# Altium project proj_LAB_main.PrjPcb
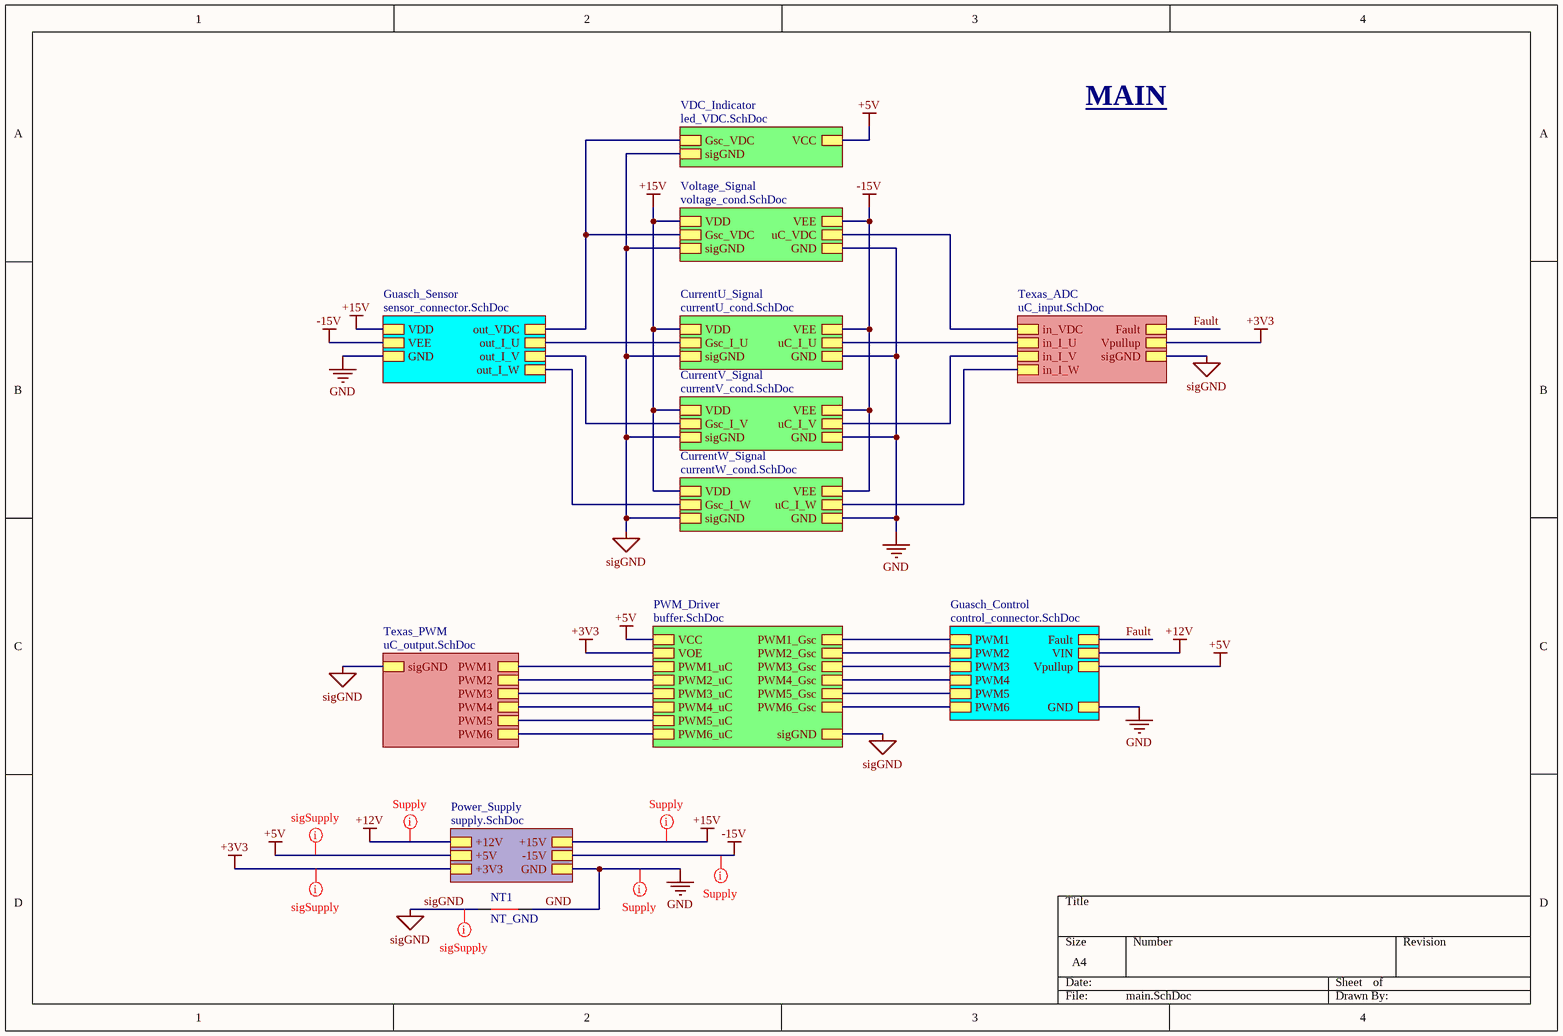
[diagram p0: main.SchDoc]
12 sheets, 127 parts. Net scope: hierarchical (ports join the sheet entries above them; power ports are global).
Board files: pcb_LAB_rev0.PcbDoc, pcb_LAB_rev1.PcbDoc
Sheets:
  main.SchDoc
    PWM_Driver = buffer.SchDoc
    Guasch_Control = control_connector.SchDoc
    Guasch_Sensor = sensor_connector.SchDoc
    CurrentU_Signal = currentU_cond.SchDoc
    Voltage_Signal = voltage_cond.SchDoc
    Texas_ADC = uC_input.SchDoc
    Texas_PWM = uC_output.SchDoc
    CurrentV_Signal = currentV_cond.SchDoc
    CurrentW_Signal = currentW_cond.SchDoc
    Power_Supply = supply.SchDoc
    VDC_Indicator = led_VDC.SchDoc

## Sheet main.SchDoc
size A4; SheetNumber: 1; SheetTotal: 12

### Parts
NT1  NT_GND  [NetTie_GND]  (net tie, no BOM)

### Sub-sheets
CurrentU_Signal = currentU_cond.SchDoc: Gsc_I_U, uC_I_U, VDD, VEE, GND, sigGND
CurrentV_Signal = currentV_cond.SchDoc: Gsc_I_V, uC_I_V, VDD, VEE, GND, sigGND
CurrentW_Signal = currentW_cond.SchDoc: Gsc_I_W, uC_I_W, VDD, VEE, GND, sigGND
Guasch_Control = control_connector.SchDoc: PWM1, PWM2, PWM3, Fault, PWM4, PWM5, PWM6, VIN, Vpullup, GND
Guasch_Sensor = sensor_connector.SchDoc: out_I_U, out_I_V, out_I_W, VDD, VEE, GND, out_VDC
Power_Supply = supply.SchDoc: +15V, -15V, +12V, +5V, +3V3, GND
PWM_Driver = buffer.SchDoc: PWM1_uC, PWM2_uC, PWM3_uC, PWM4_uC, PWM5_uC, PWM6_uC, PWM1_Gsc, PWM2_Gsc, PWM3_Gsc, PWM4_Gsc, PWM5_Gsc, PWM6_Gsc, VCC, VOE, sigGND
Texas_ADC = uC_input.SchDoc: in_VDC, in_I_U, in_I_V, in_I_W, Fault, Vpullup, sigGND
Texas_PWM = uC_output.SchDoc: PWM1, PWM2, PWM3, PWM4, PWM5, PWM6, sigGND
VDC_Indicator = led_VDC.SchDoc: VCC, Gsc_VDC, sigGND
Voltage_Signal = voltage_cond.SchDoc: Gsc_VDC, uC_VDC, VDD, VEE, GND, sigGND

### Nets
+3V3: sheet PWM_Driver/VOE, sheet Texas_ADC/Vpullup, sheet Power_Supply/+3V3
+5V: sheet PWM_Driver/VCC, sheet Guasch_Control/Vpullup, sheet Power_Supply/+5V, sheet VDC_Indicator/VCC
+12V: sheet Guasch_Control/VIN, sheet Power_Supply/+12V
+15V: sheet Guasch_Sensor/VDD, sheet CurrentU_Signal/VDD, sheet Voltage_Signal/VDD, sheet CurrentV_Signal/VDD, sheet CurrentW_Signal/VDD, sheet Power_Supply/+15V
-15V: sheet Guasch_Sensor/VEE, sheet CurrentU_Signal/VEE, sheet Voltage_Signal/VEE, sheet CurrentV_Signal/VEE, sheet CurrentW_Signal/VEE, sheet Power_Supply/-15V
GND: NT1.1 ; sheet Guasch_Control/GND, sheet Guasch_Sensor/GND, sheet CurrentU_Signal/GND, sheet Voltage_Signal/GND, sheet CurrentV_Signal/GND, sheet CurrentW_Signal/GND, sheet Power_Supply/GND
sigGND: NT1.0 ; sheet PWM_Driver/sigGND, sheet CurrentU_Signal/sigGND, sheet Voltage_Signal/sigGND, sheet Texas_ADC/sigGND, sheet Texas_PWM/sigGND, sheet CurrentV_Signal/sigGND, sheet CurrentW_Signal/sigGND, sheet VDC_Indicator/sigGND
A/D A2: sheet CurrentU_Signal/uC_I_U, sheet Texas_ADC/in_I_U
A/D A3: sheet Voltage_Signal/uC_VDC, sheet Texas_ADC/in_VDC
A/D A4: sheet Texas_ADC/in_I_V, sheet CurrentV_Signal/uC_I_V
A/D A5: sheet Texas_ADC/in_I_W, sheet CurrentW_Signal/uC_I_W
Fault: sheet Guasch_Control/Fault, sheet Texas_ADC/Fault
Gsc_VDC: sheet Guasch_Sensor/out_VDC, sheet Voltage_Signal/Gsc_VDC, sheet VDC_Indicator/Gsc_VDC
PWM1_Gsc: sheet PWM_Driver/PWM1_Gsc, sheet Guasch_Control/PWM1
PWM2_Gsc: sheet PWM_Driver/PWM2_Gsc, sheet Guasch_Control/PWM2
PWM2A: sheet PWM_Driver/PWM3_uC, sheet Texas_PWM/PWM3
PWM2B: sheet PWM_Driver/PWM4_uC, sheet Texas_PWM/PWM4
PWM3_Gsc: sheet PWM_Driver/PWM3_Gsc, sheet Guasch_Control/PWM3
PWM3A: sheet PWM_Driver/PWM1_uC, sheet Texas_PWM/PWM1
PWM3B: sheet PWM_Driver/PWM2_uC, sheet Texas_PWM/PWM2
PWM4_Gsc: sheet PWM_Driver/PWM4_Gsc, sheet Guasch_Control/PWM4
PWM5_Gsc: sheet PWM_Driver/PWM5_Gsc, sheet Guasch_Control/PWM5
PWM6_Gsc: sheet PWM_Driver/PWM6_Gsc, sheet Guasch_Control/PWM6
PWM6A: sheet PWM_Driver/PWM5_uC, sheet Texas_PWM/PWM5
PWM6B: sheet PWM_Driver/PWM6_uC, sheet Texas_PWM/PWM6
NetJ1_3: sheet Guasch_Sensor/out_I_U, sheet CurrentU_Signal/Gsc_I_U
NetJ1_4: sheet Guasch_Sensor/out_I_V, sheet CurrentV_Signal/Gsc_I_V
NetJ1_5: sheet Guasch_Sensor/out_I_W, sheet CurrentW_Signal/Gsc_I_W

### Layout directives
net class Supply: +12V, +15V, -15V, GND
net class sigSupply: +3V3, +5V, sigGND

### Notes on the sheet
- MAIN

### Library data of the parts
NT1 = NetTIe_GND: Net Tie for GND, at bottom layer

## Sheet buffer.SchDoc
size A4; SheetNumber: 8; SheetTotal: 12
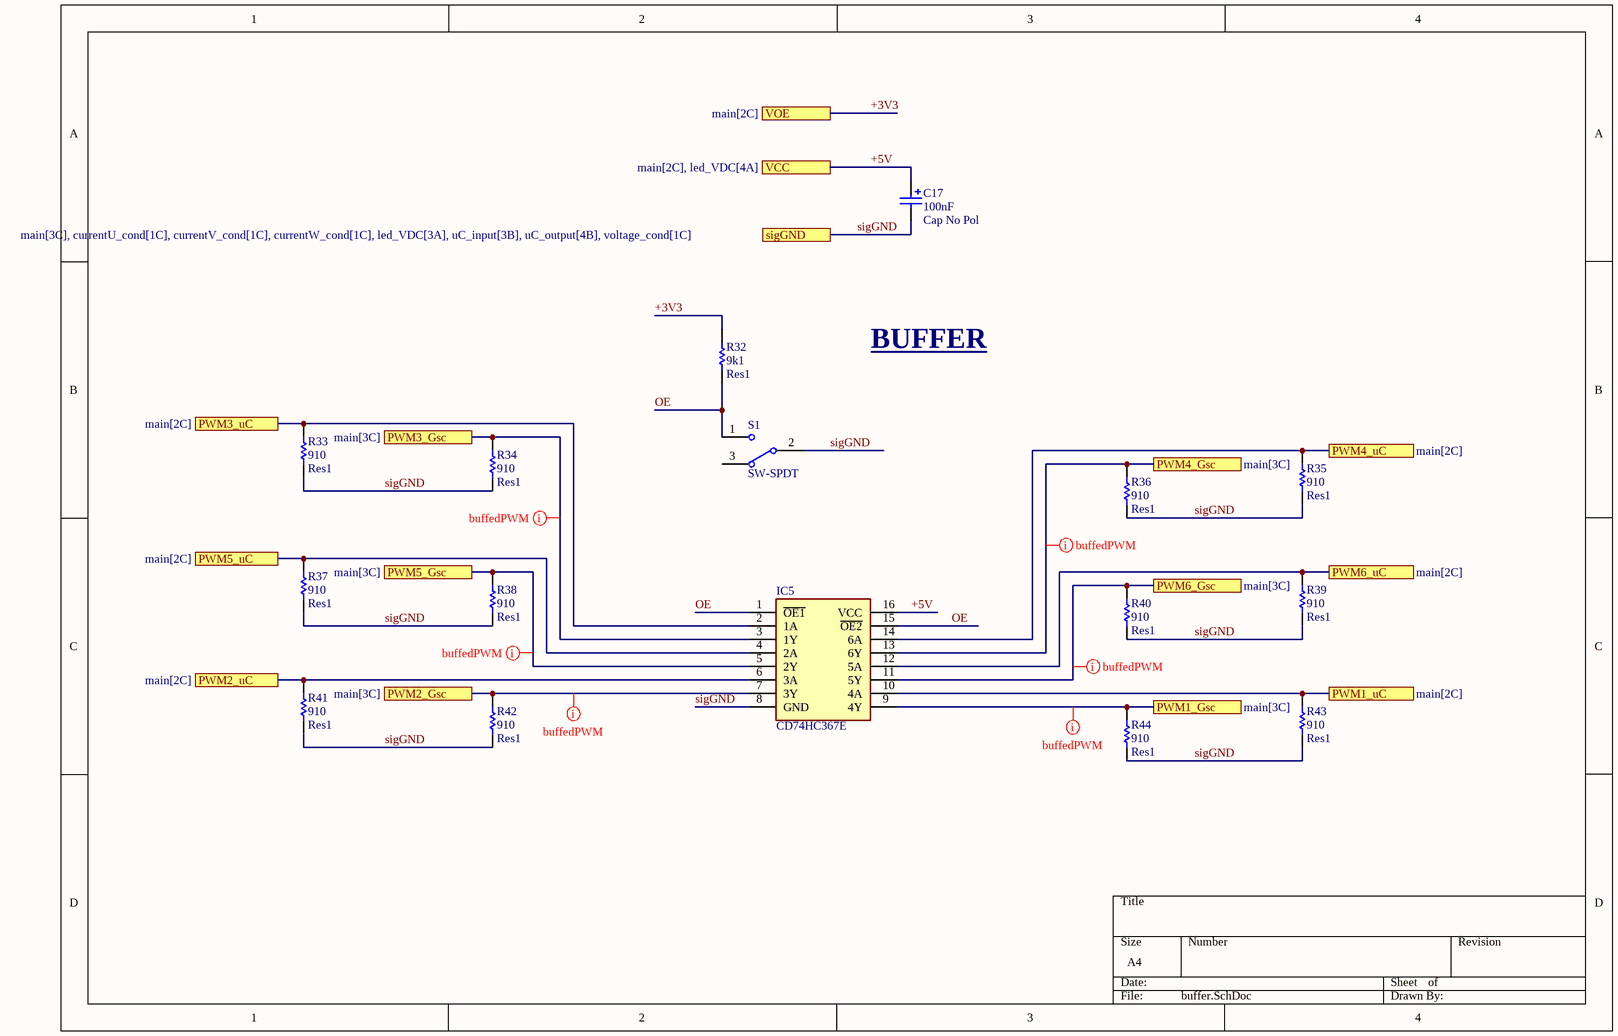
[diagram p1: buffer.SchDoc]

### Parts
C17  Cap No Pol  value 100nF  [RAD-0.1_mod]
IC5  CD74HC367E  [DIP-16_mod]
R32  Res1  value 9k1  [AXIAL-0.3_mod]
R33  Res1  value 910  [AXIAL-0.3_mod]
R34  Res1  value 910  [AXIAL-0.3_mod]
R35  Res1  value 910  [AXIAL-0.3_mod]
R36  Res1  value 910  [AXIAL-0.3_mod]
R37  Res1  value 910  [AXIAL-0.3_mod]
R38  Res1  value 910  [AXIAL-0.3_mod]
R39  Res1  value 910  [AXIAL-0.3_mod]
R40  Res1  value 910  [AXIAL-0.3_mod]
R41  Res1  value 910  [AXIAL-0.3_mod]
R42  Res1  value 910  [AXIAL-0.3_mod]
R43  Res1  value 910  [AXIAL-0.3_mod]
R44  Res1  value 910  [AXIAL-0.3_mod]
S1  SW-SPDT  [MHDR1X3_mod]

### Ports
PWM1_Gsc (see main[3C]), PWM1_uC (see main[2C]), PWM2_Gsc (see main[3C]), PWM2_uC (see main[2C]), PWM3_Gsc (see main[3C]), PWM3_uC (see main[2C]), PWM4_Gsc (see main[3C]), PWM4_uC (see main[2C]), PWM5_Gsc (see main[3C]), PWM5_uC (see main[2C]), PWM6_Gsc (see main[3C]), PWM6_uC (see main[2C]), sigGND (see main[3C], currentU_cond[1C], currentV_cond[1C], currentW_cond[1C], led_VDC[3A], uC_input[3B], uC_output[4B], voltage_cond[1C]), VCC (see main[2C], led_VDC[4A]), VOE (see main[2C])

### Nets
+3V3: R32.2 ; port VOE
+5V: C17.1 IC5.16(VCC) ; port VCC
sigGND: C17.2 IC5.8(GND) R33.1 R34.1 R35.1 R36.1 R37.1 R38.1 R39.1 R40.1 R41.1 R42.1 R43.1 R44.1 S1.2 ; port sigGND
OE: IC5.1(~{OE1}) IC5.15(~{OE2}) R32.1 S1.1
PWM1_Gsc: IC5.9(4Y) R44.2 ; port PWM1_Gsc
PWM2_Gsc: IC5.7(3Y) R42.2 ; port PWM2_Gsc
PWM2A: IC5.2(1A) R33.2 ; port PWM3_uC
PWM2B: IC5.14(6A) R35.2 ; port PWM4_uC
PWM3_Gsc: IC5.3(1Y) R34.2 ; port PWM3_Gsc
PWM3A: IC5.10(4A) R43.2 ; port PWM1_uC
PWM3B: IC5.6(3A) R41.2 ; port PWM2_uC
PWM4_Gsc: IC5.13(6Y) R36.2 ; port PWM4_Gsc
PWM5_Gsc: IC5.5(2Y) R38.2 ; port PWM5_Gsc
PWM6_Gsc: IC5.11(5Y) R40.2 ; port PWM6_Gsc
PWM6A: IC5.4(2A) R37.2 ; port PWM5_uC
PWM6B: IC5.12(5A) R39.2 ; port PWM6_uC

Not connected (* = marked no-connect by the designer): S1 3

### Layout directives
net class buffedPWM: PWM1_Gsc, PWM2_Gsc, PWM3_Gsc, PWM4_Gsc, PWM5_Gsc, PWM6_Gsc

### Notes on the sheet
- BUFFER

### Library data of the parts
C17 = Cap No Pol: Polarized Capacitor (Radial); Published: 8-Jun-2000; LatestRevisionDate: 17-Jul-2002; LatestRevisionNote: Re-released for DXP Platform.; PackageReference: RB7.6-15; Publisher: Altium Limited; PackageDescription: Polarized Capacitor (Radial); 2 Leads
IC5 = CD74HC367E: Integrated Circuit; Manufacturer_Name: Texas Instruments; Datasheet Link: https://www.ti.com/lit/ds/symlink/cd74hc367.pdf?ts=1619589374451&ref_url=https%253A%252F%252Fwww.ti.com%252Fstore%252Fti%252Fen%252Fp%252Fproduct%252F%253Fp%253DCD74HC367E; Height: 5.08mm; Manufacturer_Part_Number: CD74HC367E; Mouser Part Number: 595-CD74HC367E; Mouser Price/Stock: https://www.mouser.co.uk/ProductDetail/Texas-Instruments/CD74HC367E?qs=xFfolx0DHx1dmtXXzN7naA%3D%3D
R32-R44 = Res1: Resistor; Published: 8-Jun-2000; LatestRevisionDate: 17-Jul-2002; LatestRevisionNote: Re-released for DXP Platform.; PackageReference: AXIAL-0.3; Publisher: Altium Limited; PackageDescription: Axial Device, Thru-Hole; 2 Leads; 0.3 in Pin Spacing
S1 = SW-SPDT: SPDT Subminiature Toggle Switch, Right Angle Mounting, Vertical Actuation; Published: 24-Mar-1999; LatestRevisionDate: 17-Dec-2003; LatestRevisionNote: Schematic revised, PCB Footprint replaced.; DatasheetVersion: 05-Dec-2000; PackageReference: TL36WW15050; Publisher: Altium Limited; PackageDescription: Switch; 4 Leads; ComponentLink1Description: Manufacturer Link; ComponentLink1URL: http://www.apem.com

## Sheet control_connector.SchDoc
size A4; SheetNumber: 7; SheetTotal: 12; SPICEModelCacheRONAVTZR: <root> / <DocumentId>RONAVTZR</DocumentId> / </root>
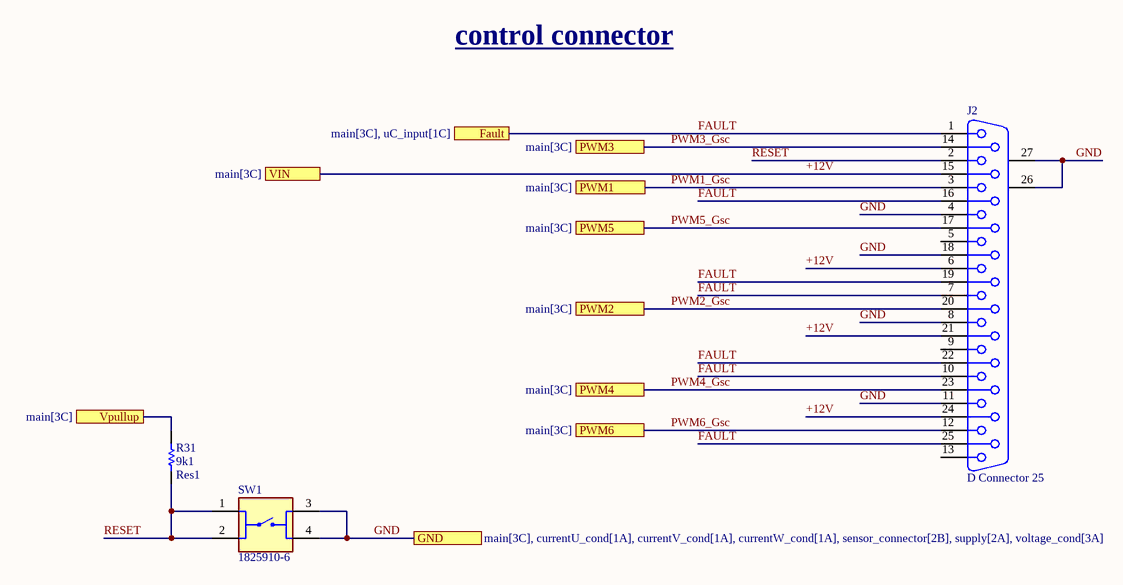
[diagram p2: control_connector.SchDoc]

### Parts
J2  D Connector 25  [DSUB1.385-2H25A_mod]
R31  Res1  value 9k1  [AXIAL-0.3_mod]
SW1  1825910-6  [SW_1825910-6-4_mod]

### Ports
Fault (see main[3C], uC_input[1C]), GND (see main[3C], currentU_cond[1A], currentV_cond[1A], currentW_cond[1A], sensor_connector[2B], supply[2A], voltage_cond[3A]), PWM1 (see main[3C]), PWM2 (see main[3C]), PWM3 (see main[3C]), PWM4 (see main[3C]), PWM5 (see main[3C]), PWM6 (see main[3C]), VIN (see main[3C]), Vpullup (see main[3C])

### Nets
+5V: R31.2 ; port Vpullup
+12V: J2.6 J2.15 J2.21 J2.24 ; port VIN
GND: J2.4 J2.8 J2.11 J2.18 J2.26(MH1) J2.27(MH2) SW1.3 SW1.4 ; port GND
Fault: J2.1 J2.7 J2.10 J2.16 J2.19 J2.22 J2.25 ; port Fault
PWM1_Gsc: J2.3 ; port PWM1
PWM2_Gsc: J2.20 ; port PWM2
PWM3_Gsc: J2.14 ; port PWM3
PWM4_Gsc: J2.23 ; port PWM4
PWM5_Gsc: J2.17 ; port PWM5
PWM6_Gsc: J2.12 ; port PWM6
RESET: J2.2 R31.1 SW1.1 SW1.2

Not connected (* = marked no-connect by the designer): J2 5 9 13

### Notes on the sheet
- control connector

### Library data of the parts
J2 = D Connector 25: Receptacle Assembly, 25 Position, Right Angle; PackageDocument: U; Positions: 25; Published: 15-Jun-2001; LatestRevisionDate: 17-Jul-2002; LatestRevisionNote: Re-released for DXP Platform.; DatasheetDocument: 19-Mar-1999; PackageReference: 787202; Publisher: Altium Limited; Orientation: Right Angle; Gender: Receptacle
R31 = Res1: Resistor; Published: 8-Jun-2000; LatestRevisionDate: 17-Jul-2002; LatestRevisionNote: Re-released for DXP Platform.; PackageReference: AXIAL-0.3; Publisher: Altium Limited; PackageDescription: Axial Device, Thru-Hole; 2 Leads; 0.3 in Pin Spacing
SW1 = 1825910-6: Switch Push Button OFF (ON) SPST Round Button 0.05A 24VDC Momentary Contact PC Pins Thru-Hole; MF: TE Connectivity; Value: *; MP: 1825910-6; Package: None; Check_prices: https://www.snapeda.com/parts/1825910-6/TE+Connectivity+ALCOSWITCH+Switches/view-part/?ref=eda; SnapEDA_Link: https://www.snapeda.com/parts/1825910-6/TE+Connectivity+ALCOSWITCH+Switches/view-part/?ref=snap; Digi-Key_Part_Number: 450-1650-ND; Purchase-URL: https://pricing.snapeda.com/search/part/1825910-6/?ref=eda

## Sheet sensor_connector.SchDoc
size A4; SheetNumber: 6; SheetTotal: 12
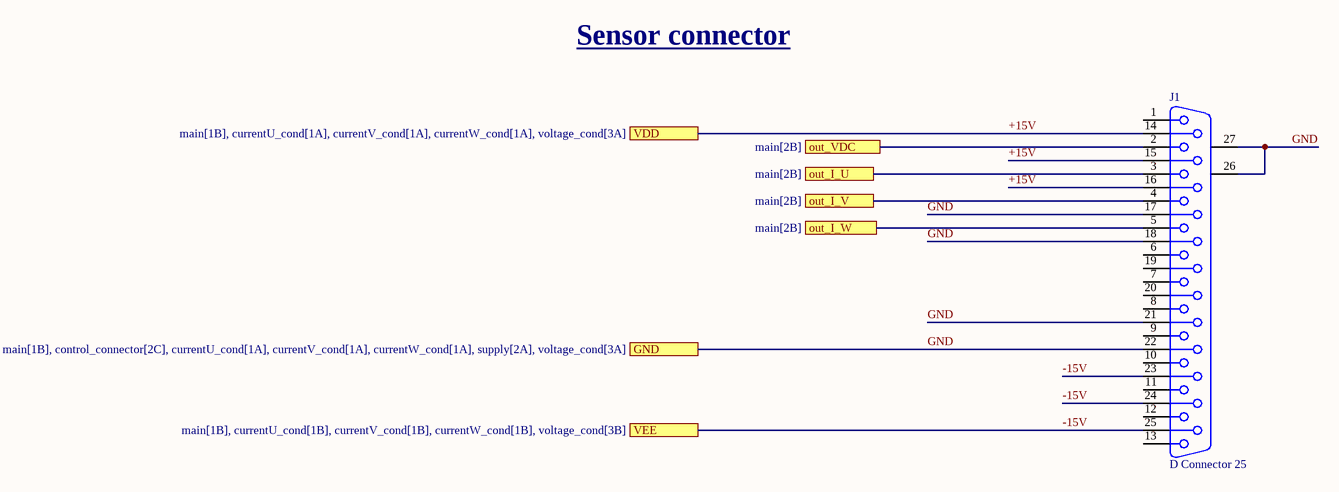
[diagram p3: sensor_connector.SchDoc]

### Parts
J1  D Connector 25  [DSUB1.385-2H25A_mod]

### Ports
GND (see main[1B], control_connector[2C], currentU_cond[1A], currentV_cond[1A], currentW_cond[1A], supply[2A], voltage_cond[3A]), out_I_U (see main[2B]), out_I_V (see main[2B]), out_I_W (see main[2B]), out_VDC (see main[2B]), VDD (see main[1B], currentU_cond[1A], currentV_cond[1A], currentW_cond[1A], voltage_cond[3A]), VEE (see main[1B], currentU_cond[1B], currentV_cond[1B], currentW_cond[1B], voltage_cond[3B])

### Nets
+15V: J1.14 J1.15 J1.16 ; port VDD
-15V: J1.23 J1.24 J1.25 ; port VEE
GND: J1.17 J1.18 J1.21 J1.22 J1.26(MH1) J1.27(MH2) ; port GND
Gsc_VDC: J1.2 ; port out_VDC
NetJ1_3: J1.3 ; port out_I_U
NetJ1_4: J1.4 ; port out_I_V
NetJ1_5: J1.5 ; port out_I_W

Not connected (* = marked no-connect by the designer): J1 1 6 7 8 9 10 11 12 13 19 20

### Notes on the sheet
- Sensor connector

### Library data of the parts
J1 = D Connector 25: as J2 on sheet control_connector; Published: 15-Jun-2001; LatestRevisionDate: 17-Jul-2002; LatestRevisionNote: Re-released for DXP Platform.; DatasheetDocument: 19-Mar-1999; PackageReference: 787202; Publisher: Altium Limited; Orientation: Right Angle; Gender: Receptacle

## Sheet currentU_cond.SchDoc
size A4; SheetNumber: 2; SheetTotal: 12; SPICEModelCacheJNOYGZHY: <root> / <DocumentId>JNOYGZHY</DocumentId> / </root>
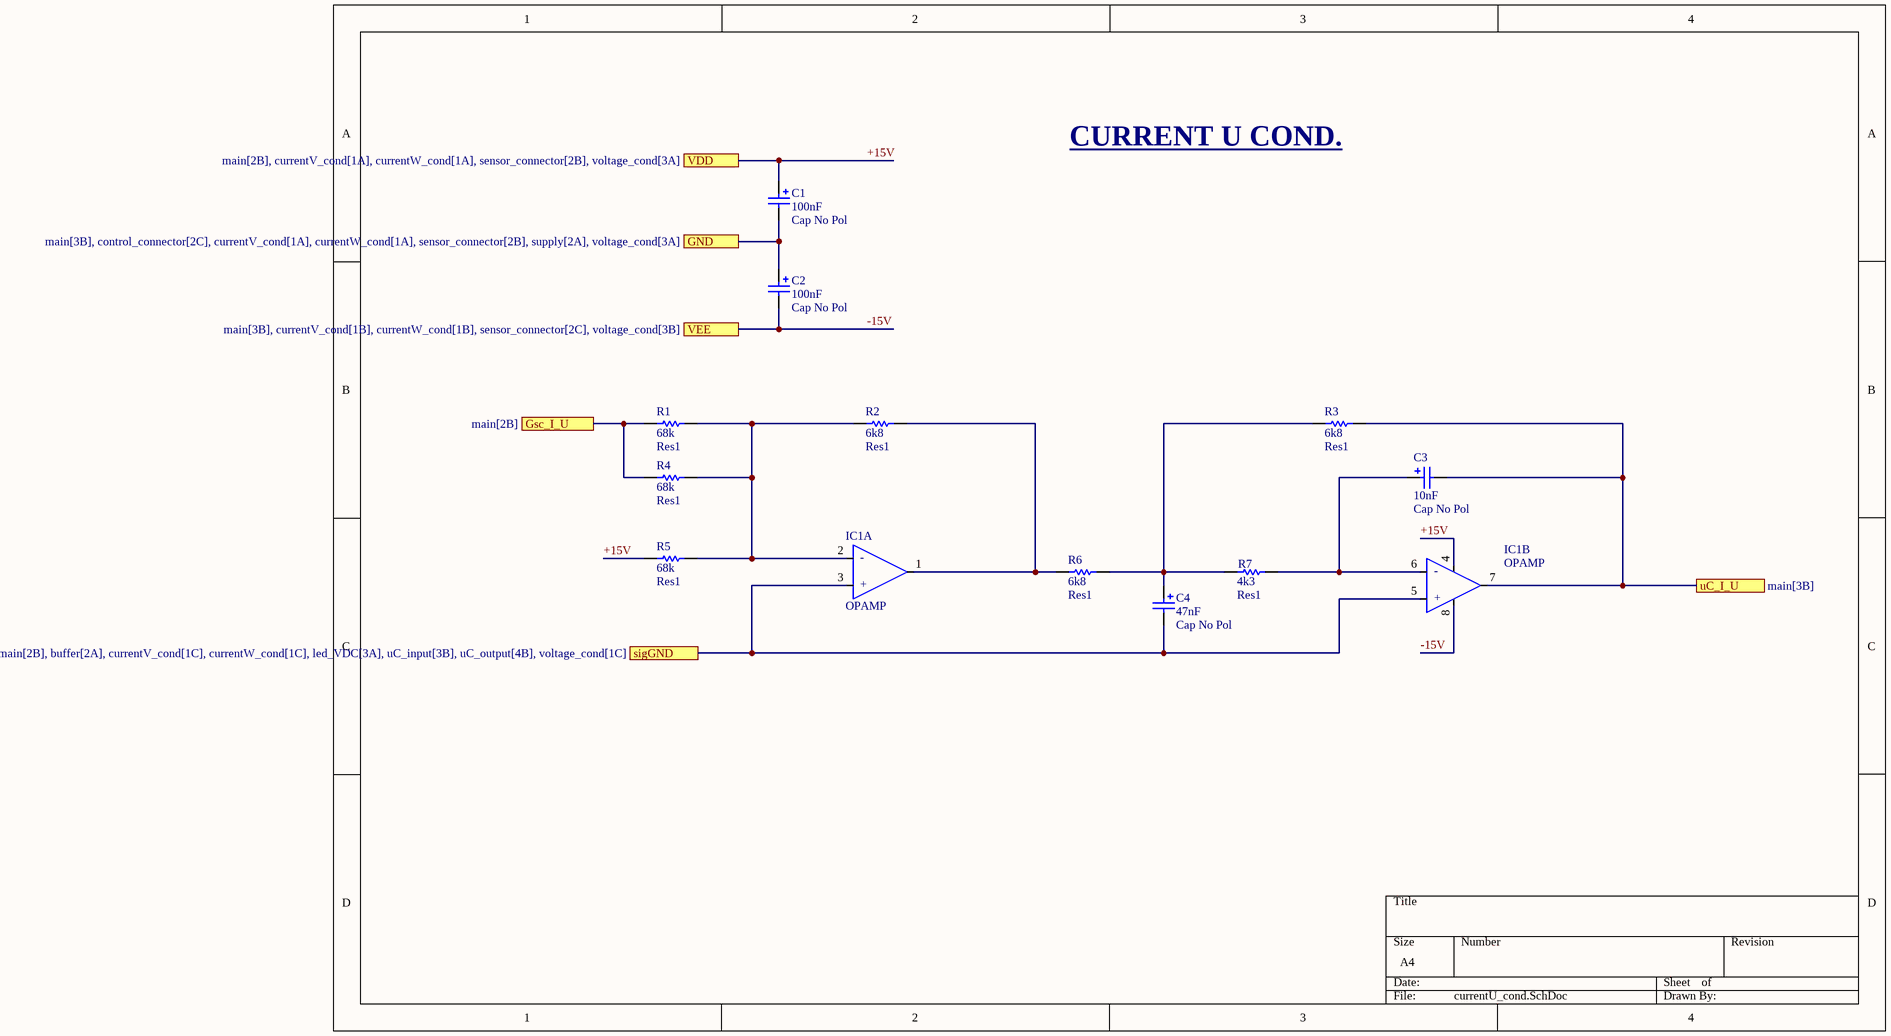
[diagram p4: currentU_cond.SchDoc]

### Parts
C1  Cap No Pol  value 100nF  [RAD-0.1_mod]
C2  Cap No Pol  value 100nF  [RAD-0.1_mod]
C3  Cap No Pol  value 10nF  [RAD-0.1_mod]
C4  Cap No Pol  value 47nF  [RAD-0.1_mod]
IC1  OPAMP  [DIP-8_mod]  (parts A,B of 2)
R1  Res1  value 68k  [AXIAL-0.3_mod]
R2  Res1  value 6k8  [AXIAL-0.3_mod]
R3  Res1  value 6k8  [AXIAL-0.3_mod]
R4  Res1  value 68k  [AXIAL-0.3_mod]
R5  Res1  value 68k  [AXIAL-0.3_mod]
R6  Res1  value 6k8  [AXIAL-0.3_mod]
R7  Res1  value 4k3  [AXIAL-0.3_mod]

### Ports
GND (see main[3B], control_connector[2C], currentV_cond[1A], currentW_cond[1A], sensor_connector[2B], supply[2A], voltage_cond[3A]), Gsc_I_U (see main[2B]), sigGND (see main[2B], buffer[2A], currentV_cond[1C], currentW_cond[1C], led_VDC[3A], uC_input[3B], uC_output[4B], voltage_cond[1C]), uC_I_U (see main[3B]), VDD (see main[2B], currentV_cond[1A], currentW_cond[1A], sensor_connector[2B], voltage_cond[3A]), VEE (see main[3B], currentV_cond[1B], currentW_cond[1B], sensor_connector[2C], voltage_cond[3B])

### Nets
+15V: C1.1 IC1.4(-V) R5.1 ; port VDD
-15V: C2.2 IC1.8(V+) ; port VEE
GND: C1.2 C2.1 ; port GND
sigGND: C4.2 IC1.3(IN_A_+) IC1.5(IN_B_+) ; port sigGND
A/D A2: C3.2 IC1.7(OUT_B) R3.2 ; port uC_I_U
NetC3_1: C3.1 IC1.6(IN_B_-) R7.2
NetC4_1: C4.1 R3.1 R6.2 R7.1
NetIC1_1: IC1.1(OUT_A) R2.2 R6.1
NetIC1_2: IC1.2(IN_A_-) R1.2 R2.1 R4.2 R5.2
NetJ1_3: R1.1 R4.1 ; port Gsc_I_U

### Notes on the sheet
- CURRENT U COND.
- (in symbol ADTL082, part A) -; +
- (in symbol ADTL082, part B) -; +

### Library data of the parts
C1-C4 = Cap No Pol: Polarized Capacitor (Radial); Published: 8-Jun-2000; LatestRevisionDate: 17-Jul-2002; LatestRevisionNote: Re-released for DXP Platform.; PackageReference: RB7.6-15; Publisher: Altium Limited; PackageDescription: Polarized Capacitor (Radial); 2 Leads
IC1 = ADTL082
R1-R7 = Res1: Resistor; Published: 8-Jun-2000; LatestRevisionDate: 17-Jul-2002; LatestRevisionNote: Re-released for DXP Platform.; PackageReference: AXIAL-0.3; Publisher: Altium Limited; PackageDescription: Axial Device, Thru-Hole; 2 Leads; 0.3 in Pin Spacing

## Sheet voltage_cond.SchDoc
size A4; SheetNumber: 5; SheetTotal: 12
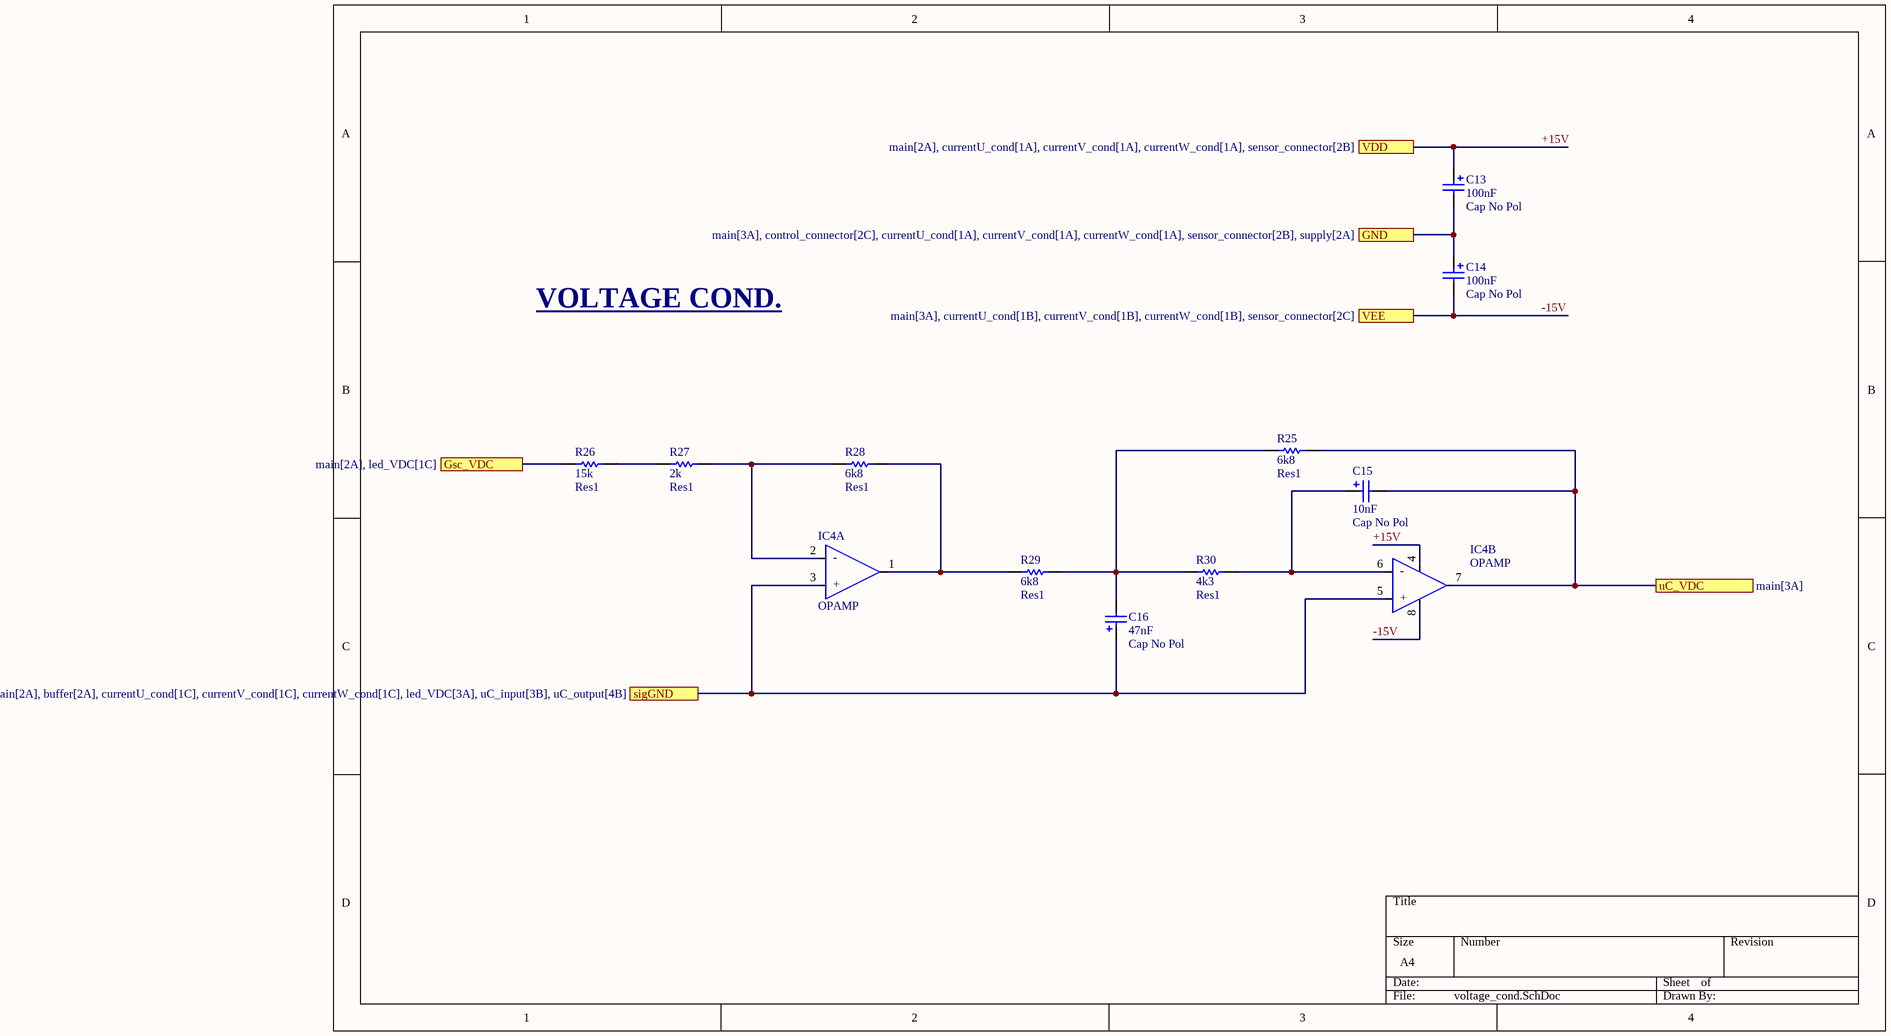
[diagram p5: voltage_cond.SchDoc]

### Parts
C13  Cap No Pol  value 100nF  [RAD-0.1_mod]
C14  Cap No Pol  value 100nF  [RAD-0.1_mod]
C15  Cap No Pol  value 10nF  [RAD-0.1_mod]
C16  Cap No Pol  value 47nF  [RAD-0.1_mod]
IC4  OPAMP  [DIP-8_mod]  (parts A,B of 2)
R25  Res1  value 6k8  [AXIAL-0.3_mod]
R26  Res1  value 15k  [AXIAL-0.3_mod]
R27  Res1  value 2k  [AXIAL-0.3_mod]
R28  Res1  value 6k8  [AXIAL-0.3_mod]
R29  Res1  value 6k8  [AXIAL-0.3_mod]
R30  Res1  value 4k3  [AXIAL-0.3_mod]

### Ports
GND (see main[3A], control_connector[2C], currentU_cond[1A], currentV_cond[1A], currentW_cond[1A], sensor_connector[2B], supply[2A]), Gsc_VDC (see main[2A], led_VDC[1C]), sigGND (see main[2A], buffer[2A], currentU_cond[1C], currentV_cond[1C], currentW_cond[1C], led_VDC[3A], uC_input[3B], uC_output[4B]), uC_VDC (see main[3A]), VDD (see main[2A], currentU_cond[1A], currentV_cond[1A], currentW_cond[1A], sensor_connector[2B]), VEE (see main[3A], currentU_cond[1B], currentV_cond[1B], currentW_cond[1B], sensor_connector[2C])

### Nets
+15V: C13.1 IC4.4(-V) ; port VDD
-15V: C14.2 IC4.8(V+) ; port VEE
GND: C13.2 C14.1 ; port GND
sigGND: C16.1 IC4.3(IN_A_+) IC4.5(IN_B_+) ; port sigGND
A/D A3: C15.2 IC4.7(OUT_B) R25.2 ; port uC_VDC
Gsc_VDC: R26.1 ; port Gsc_VDC
NetC15_1: C15.1 IC4.6(IN_B_-) R30.2
NetC16_2: C16.2 R25.1 R29.2 R30.1
NetIC4_1: IC4.1(OUT_A) R28.2 R29.1
NetIC4_2: IC4.2(IN_A_-) R27.2 R28.1
NetR26_2: R26.2 R27.1

### Notes on the sheet
- VOLTAGE COND.
- (in symbol ADTL082, part A) -; +
- (in symbol ADTL082, part B) -; +

### Library data of the parts
C13-C16 = Cap No Pol: Polarized Capacitor (Radial); Published: 8-Jun-2000; LatestRevisionDate: 17-Jul-2002; LatestRevisionNote: Re-released for DXP Platform.; PackageReference: RB7.6-15; Publisher: Altium Limited; PackageDescription: Polarized Capacitor (Radial); 2 Leads
IC4 = ADTL082
R25-R30 = Res1: Resistor; Published: 8-Jun-2000; LatestRevisionDate: 17-Jul-2002; LatestRevisionNote: Re-released for DXP Platform.; PackageReference: AXIAL-0.3; Publisher: Altium Limited; PackageDescription: Axial Device, Thru-Hole; 2 Leads; 0.3 in Pin Spacing

## Sheet uC_input.SchDoc
size A; SheetNumber: 10; SheetTotal: 12; SPICEModelCacheXWDQNBJN: <root> / <DocumentId>XWDQNBJN</DocumentId> / </root>
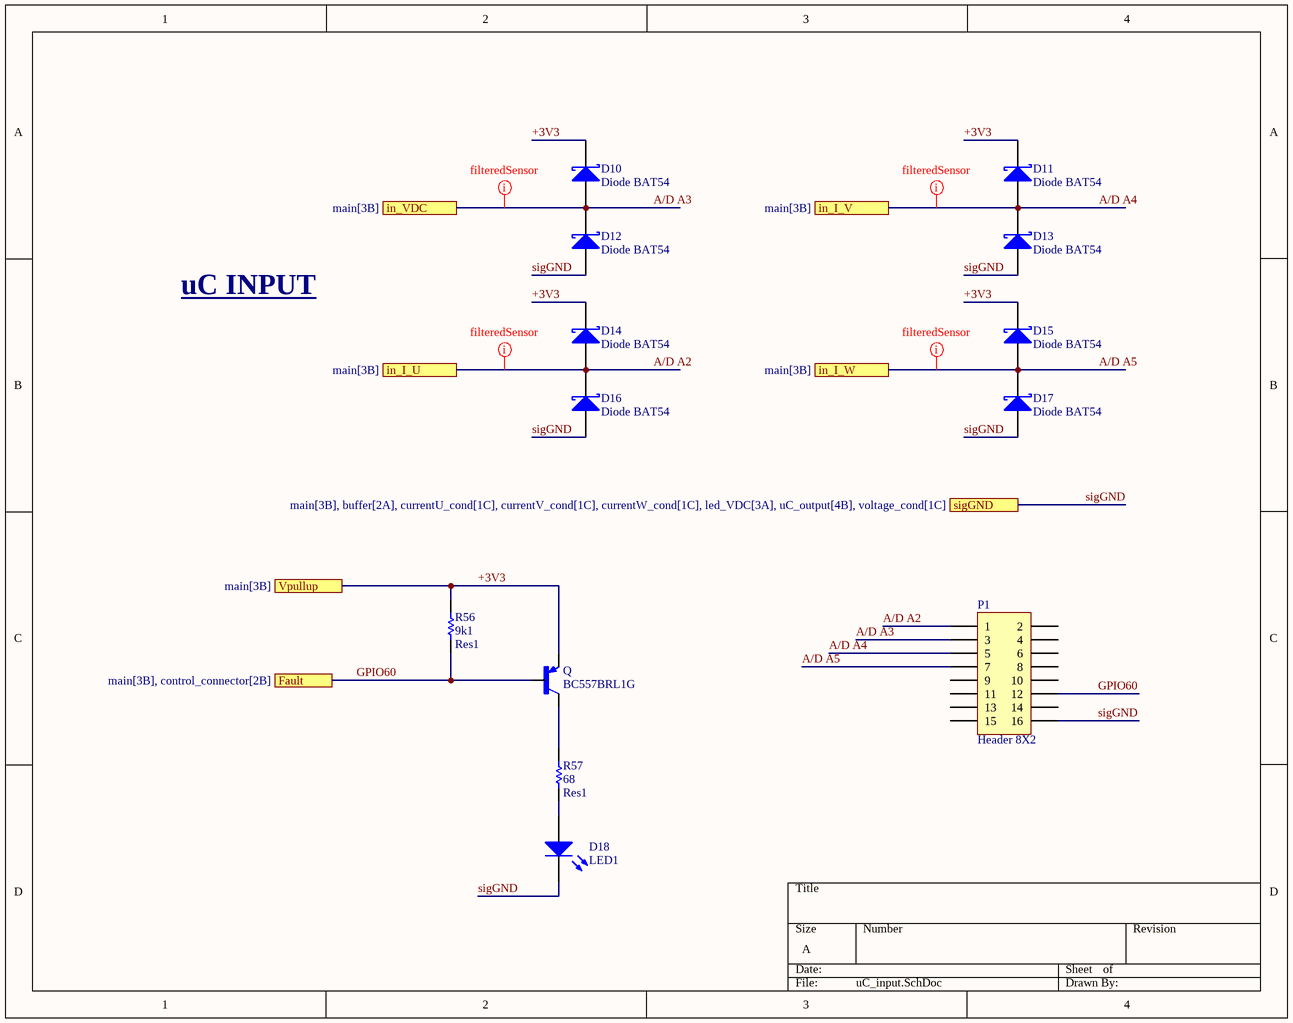
[diagram p6: uC_input.SchDoc]

### Parts
D10  Diode BAT54  [DO-41_mod]
D11  Diode BAT54  [DO-41_mod]
D12  Diode BAT54  [DO-41_mod]
D13  Diode BAT54  [DO-41_mod]
D14  Diode BAT54  [DO-41_mod]
D15  Diode BAT54  [DO-41_mod]
D16  Diode BAT54  [DO-41_mod]
D17  Diode BAT54  [DO-41_mod]
D18  LED1  [PIN2_mod]
P1  Header 8X2  [HDR2X8_mod]
Q  BC557BRL1G  [TO92260P520H933-3_mod]
R56  Res1  value 9k1  [AXIAL-0.3_mod]
R57  Res1  value 68  [AXIAL-0.3_mod]

### Ports
Fault (see main[3B], control_connector[2B]), in_I_U (see main[3B]), in_I_V (see main[3B]), in_I_W (see main[3B]), in_VDC (see main[3B]), sigGND (see main[3B], buffer[2A], currentU_cond[1C], currentV_cond[1C], currentW_cond[1C], led_VDC[3A], uC_output[4B], voltage_cond[1C]), Vpullup (see main[3B])

### Nets
+3V3: D10.2(K) D11.2(K) D14.2(K) D15.2(K) Q.3(E) R56.1 ; port Vpullup
sigGND: D12.1(A) D13.1(A) D16.1(A) D17.1(A) D18.2(K) P1.16 ; port sigGND
A/D A2: D14.1(A) D16.2(K) P1.1 ; port in_I_U
A/D A3: D10.1(A) D12.2(K) P1.3 ; port in_VDC
A/D A4: D11.1(A) D13.2(K) P1.5 ; port in_I_V
A/D A5: D15.1(A) D17.2(K) P1.7 ; port in_I_W
GPIO60: P1.12 Q.2(B) R56.2 ; port Fault  [project net Fault]
NetD18_1: D18.1(A) R57.2
NetQ_1: Q.1(C) R57.1

Not connected (* = marked no-connect by the designer): P1 2 4 6 8 9 10 11 13 14 15

### Layout directives
net class filteredSensor: A/D A2, A/D A3, A/D A4, A/D A5

### Notes on the sheet
- uC INPUT

### Library data of the parts
D10-D17 = Diode 11DQ03: Schottky Rectifier; Published: 8-Jun-2000; LatestRevisionDate: 17-Jul-2002; LatestRevisionNote: Re-released for DXP Platform.; DatasheetVersion: Dec-1997; PackageReference: DO-204AL; Publisher: Altium Limited; PackageDescription: Diode, Axial; Body 5.2 x 2.7 mm (LxDia. max), Lead Dia. 0.86 mm (max); Code_JEDEC: DO-204-AL; ComponentLink1Description: Manufacturer Link; ComponentLink1URL: http://www.irf.com/; ComponentLink2Description: Datasheet; ComponentLink2URL: http://www.irf.com/product-info/datasheets/data/11dq03.pdf
D18 = LED1: Typical RED GaAs LED; Published: 8-Jun-2000; LatestRevisionDate: 08-Jul-2005; LatestRevisionNote: Mech Layer 1 removed.; PackageReference: LED-1; Publisher: Altium Limited; PackageDescription: LED; 2 Leads
P1 = Header 8X2: Header, 8-Pin, Dual row; LatestRevisionDate: 17-Jul-2002; LatestRevisionNote: Re-released for DXP Platform.; Publisher: Altium Limited
Q = BC557BRL1G: Bipolar (BJT) Transistor PNP 45V 100mA 320MHz 625mW Through Hole TO-92-3; MF: ON Semiconductor; Availability: Good; Value: *; SnapEDA_Link: https://www.snapeda.com/parts/BC557BRL1G/ON%20Semiconductor/view-part/3219064/?ref=snap; Arrow_Electronics-Purchase-URL: https://snapeda.com/shop?store=Arrow+Electronics&id=3219064; Price: None; Package: TO-92 ON Semiconductor; MP: BC557BRL1G; DigiKey-Purchase-URL: https://snapeda.com/shop?store=DigiKey&id=3219064; BuyPart: https://www.snapeda.com/parts/BC557BRL1G/ON%20Semiconductor/view-part/3219064/?ref=eda
R56 R57 = Res1: Resistor; Published: 8-Jun-2000; LatestRevisionDate: 17-Jul-2002; LatestRevisionNote: Re-released for DXP Platform.; PackageReference: AXIAL-0.3; Publisher: Altium Limited; PackageDescription: Axial Device, Thru-Hole; 2 Leads; 0.3 in Pin Spacing

## Sheet uC_output.SchDoc
size A; SheetNumber: 11; SheetTotal: 12
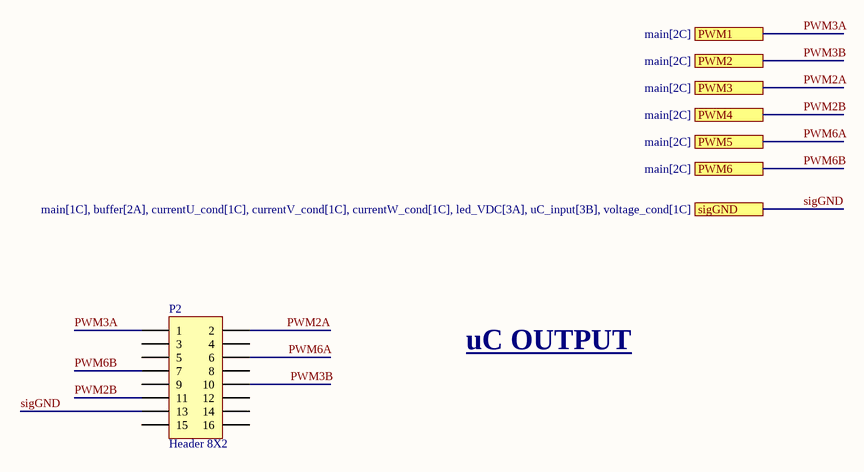
[diagram p7: uC_output.SchDoc]

### Parts
P2  Header 8X2  [HDR2X8_mod]

### Ports
PWM1 (see main[2C]), PWM2 (see main[2C]), PWM3 (see main[2C]), PWM4 (see main[2C]), PWM5 (see main[2C]), PWM6 (see main[2C]), sigGND (see main[1C], buffer[2A], currentU_cond[1C], currentV_cond[1C], currentW_cond[1C], led_VDC[3A], uC_input[3B], voltage_cond[1C])

### Nets
sigGND: P2.13 ; port sigGND
PWM2A: P2.2 ; port PWM3
PWM2B: P2.11 ; port PWM4
PWM3A: P2.1 ; port PWM1
PWM3B: P2.10 ; port PWM2
PWM6A: P2.6 ; port PWM5
PWM6B: P2.7 ; port PWM6

Not connected (* = marked no-connect by the designer): P2 3 4 5 8 9 12 14 15 16

### Notes on the sheet
- uC OUTPUT

### Library data of the parts
P2 = Header 8X2: Header, 8-Pin, Dual row; LatestRevisionDate: 17-Jul-2002; LatestRevisionNote: Re-released for DXP Platform.; Publisher: Altium Limited

## Sheet currentV_cond.SchDoc
size A4; SheetNumber: 3; SheetTotal: 12; SPICEModelCacheJNOYGZHY: <root> / <DocumentId>JNOYGZHY</DocumentId> / </root>
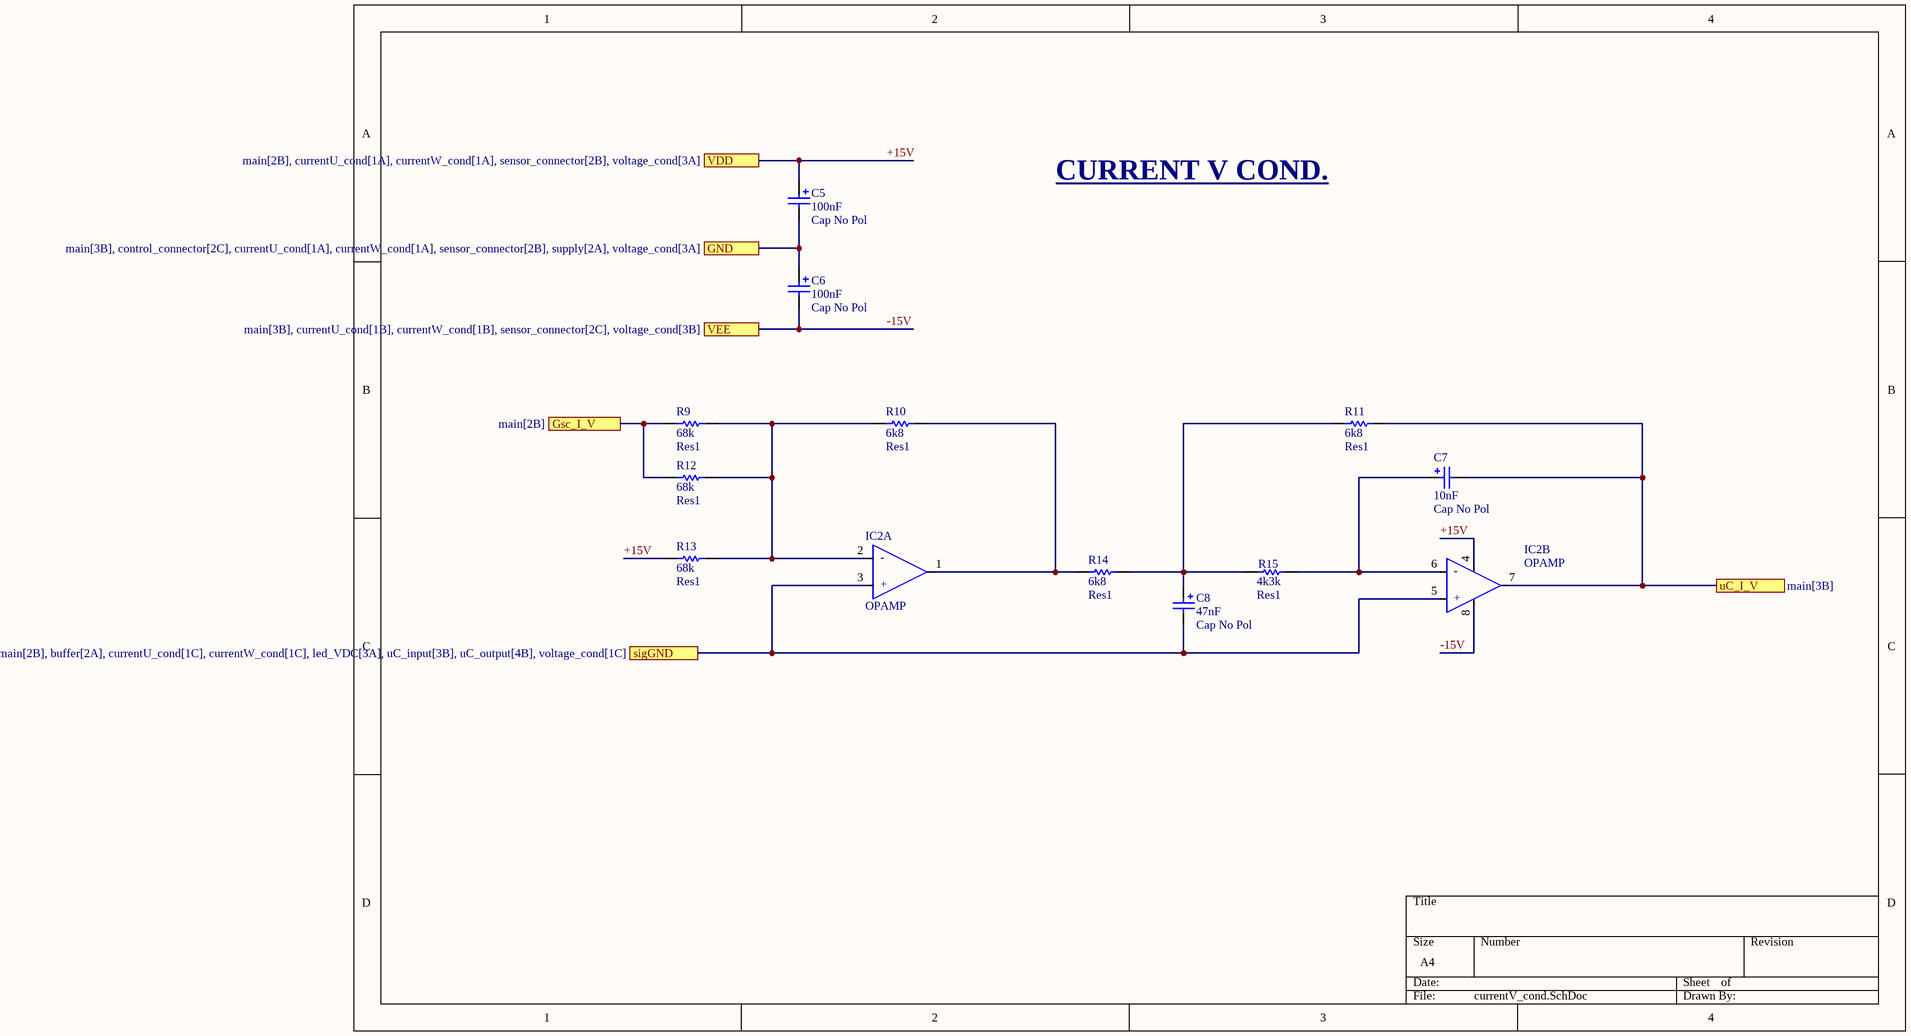
[diagram p8: currentV_cond.SchDoc]

### Parts
C5  Cap No Pol  value 100nF  [RAD-0.1_mod]
C6  Cap No Pol  value 100nF  [RAD-0.1_mod]
C7  Cap No Pol  value 10nF  [RAD-0.1_mod]
C8  Cap No Pol  value 47nF  [RAD-0.1_mod]
IC2  OPAMP  [DIP-8_mod]  (parts A,B of 2)
R9  Res1  value 68k  [AXIAL-0.3_mod]
R10  Res1  value 6k8  [AXIAL-0.3_mod]
R11  Res1  value 6k8  [AXIAL-0.3_mod]
R12  Res1  value 68k  [AXIAL-0.3_mod]
R13  Res1  value 68k  [AXIAL-0.3_mod]
R14  Res1  value 6k8  [AXIAL-0.3_mod]
R15  Res1  value 4k3k  [AXIAL-0.3_mod]

### Ports
GND (see main[3B], control_connector[2C], currentU_cond[1A], currentW_cond[1A], sensor_connector[2B], supply[2A], voltage_cond[3A]), Gsc_I_V (see main[2B]), sigGND (see main[2B], buffer[2A], currentU_cond[1C], currentW_cond[1C], led_VDC[3A], uC_input[3B], uC_output[4B], voltage_cond[1C]), uC_I_V (see main[3B]), VDD (see main[2B], currentU_cond[1A], currentW_cond[1A], sensor_connector[2B], voltage_cond[3A]), VEE (see main[3B], currentU_cond[1B], currentW_cond[1B], sensor_connector[2C], voltage_cond[3B])

### Nets
+15V: C5.1 IC2.4(-V) R13.1 ; port VDD
-15V: C6.2 IC2.8(V+) ; port VEE
GND: C5.2 C6.1 ; port GND
sigGND: C8.2 IC2.3(IN_A_+) IC2.5(IN_B_+) ; port sigGND
A/D A4: C7.2 IC2.7(OUT_B) R11.2 ; port uC_I_V
NetC7_1: C7.1 IC2.6(IN_B_-) R15.2
NetC8_1: C8.1 R11.1 R14.2 R15.1
NetIC2_1: IC2.1(OUT_A) R10.2 R14.1
NetIC2_2: IC2.2(IN_A_-) R9.2 R10.1 R12.2 R13.2
NetJ1_4: R9.1 R12.1 ; port Gsc_I_V

### Notes on the sheet
- CURRENT V COND.
- (in symbol ADTL082, part A) -; +
- (in symbol ADTL082, part B) -; +

### Library data of the parts
C5-C8 = Cap No Pol: Polarized Capacitor (Radial); Published: 8-Jun-2000; LatestRevisionDate: 17-Jul-2002; LatestRevisionNote: Re-released for DXP Platform.; PackageReference: RB7.6-15; Publisher: Altium Limited; PackageDescription: Polarized Capacitor (Radial); 2 Leads
IC2 = ADTL082
R9-R15 = Res1: Resistor; Published: 8-Jun-2000; LatestRevisionDate: 17-Jul-2002; LatestRevisionNote: Re-released for DXP Platform.; PackageReference: AXIAL-0.3; Publisher: Altium Limited; PackageDescription: Axial Device, Thru-Hole; 2 Leads; 0.3 in Pin Spacing

## Sheet currentW_cond.SchDoc
size A4; SheetNumber: 4; SheetTotal: 12; SPICEModelCacheJNOYGZHY: <root> / <DocumentId>JNOYGZHY</DocumentId> / </root>
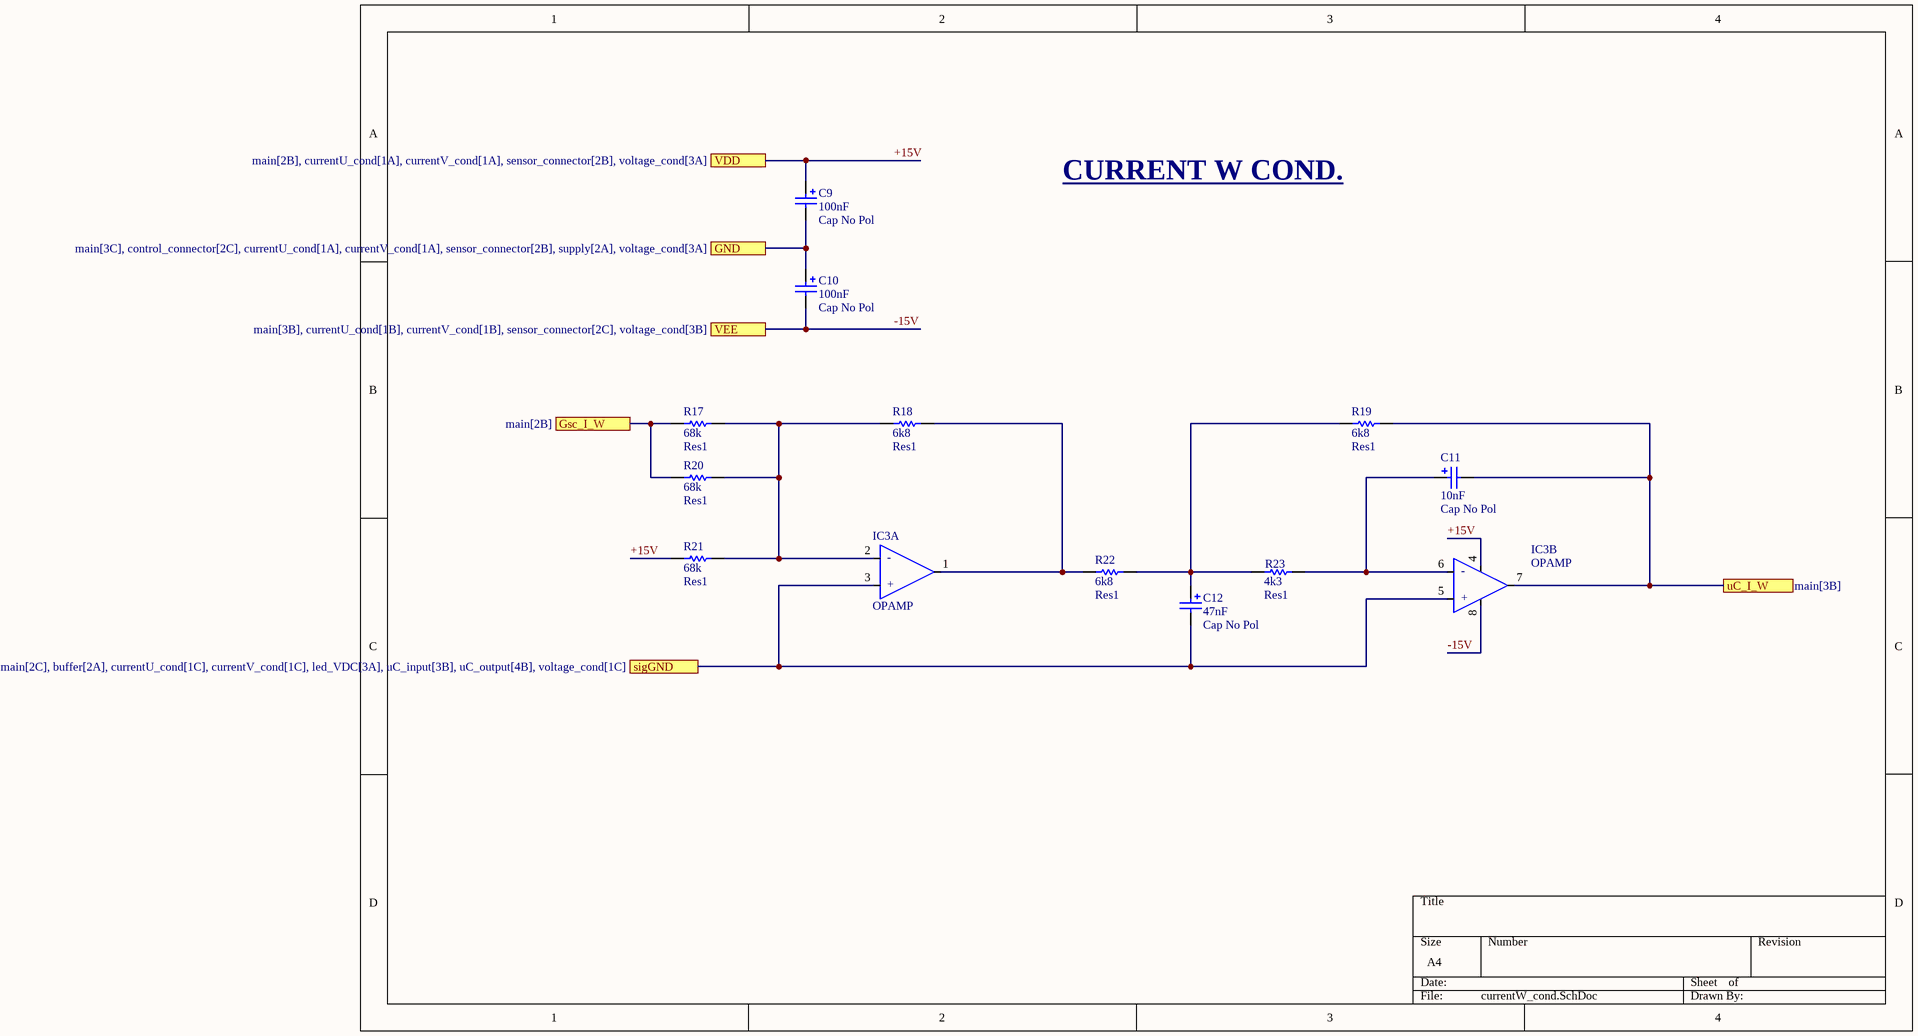
[diagram p9: currentW_cond.SchDoc]

### Parts
C9  Cap No Pol  value 100nF  [RAD-0.1_mod]
C10  Cap No Pol  value 100nF  [RAD-0.1_mod]
C11  Cap No Pol  value 10nF  [RAD-0.1_mod]
C12  Cap No Pol  value 47nF  [RAD-0.1_mod]
IC3  OPAMP  [DIP-8_mod]  (parts A,B of 2)
R17  Res1  value 68k  [AXIAL-0.3_mod]
R18  Res1  value 6k8  [AXIAL-0.3_mod]
R19  Res1  value 6k8  [AXIAL-0.3_mod]
R20  Res1  value 68k  [AXIAL-0.3_mod]
R21  Res1  value 68k  [AXIAL-0.3_mod]
R22  Res1  value 6k8  [AXIAL-0.3_mod]
R23  Res1  value 4k3  [AXIAL-0.3_mod]

### Ports
GND (see main[3C], control_connector[2C], currentU_cond[1A], currentV_cond[1A], sensor_connector[2B], supply[2A], voltage_cond[3A]), Gsc_I_W (see main[2B]), sigGND (see main[2C], buffer[2A], currentU_cond[1C], currentV_cond[1C], led_VDC[3A], uC_input[3B], uC_output[4B], voltage_cond[1C]), uC_I_W (see main[3B]), VDD (see main[2B], currentU_cond[1A], currentV_cond[1A], sensor_connector[2B], voltage_cond[3A]), VEE (see main[3B], currentU_cond[1B], currentV_cond[1B], sensor_connector[2C], voltage_cond[3B])

### Nets
+15V: C9.1 IC3.4(-V) R21.1 ; port VDD
-15V: C10.2 IC3.8(V+) ; port VEE
GND: C9.2 C10.1 ; port GND
sigGND: C12.2 IC3.3(IN_A_+) IC3.5(IN_B_+) ; port sigGND
A/D A5: C11.2 IC3.7(OUT_B) R19.2 ; port uC_I_W
NetC11_1: C11.1 IC3.6(IN_B_-) R23.2
NetC12_1: C12.1 R19.1 R22.2 R23.1
NetIC3_1: IC3.1(OUT_A) R18.2 R22.1
NetIC3_2: IC3.2(IN_A_-) R17.2 R18.1 R20.2 R21.2
NetJ1_5: R17.1 R20.1 ; port Gsc_I_W

### Notes on the sheet
- CURRENT W COND.
- (in symbol ADTL082, part A) -; +
- (in symbol ADTL082, part B) -; +

### Library data of the parts
C9-C12 = Cap No Pol: Polarized Capacitor (Radial); Published: 8-Jun-2000; LatestRevisionDate: 17-Jul-2002; LatestRevisionNote: Re-released for DXP Platform.; PackageReference: RB7.6-15; Publisher: Altium Limited; PackageDescription: Polarized Capacitor (Radial); 2 Leads
IC3 = ADTL082
R17-R23 = Res1: Resistor; Published: 8-Jun-2000; LatestRevisionDate: 17-Jul-2002; LatestRevisionNote: Re-released for DXP Platform.; PackageReference: AXIAL-0.3; Publisher: Altium Limited; PackageDescription: Axial Device, Thru-Hole; 2 Leads; 0.3 in Pin Spacing

## Sheet supply.SchDoc
size A4; SheetNumber: 9; SheetTotal: 12; SPICEModelCacheMDRHNIGR: <root> / <DocumentId>MDRHNIGR</DocumentId> / </root>
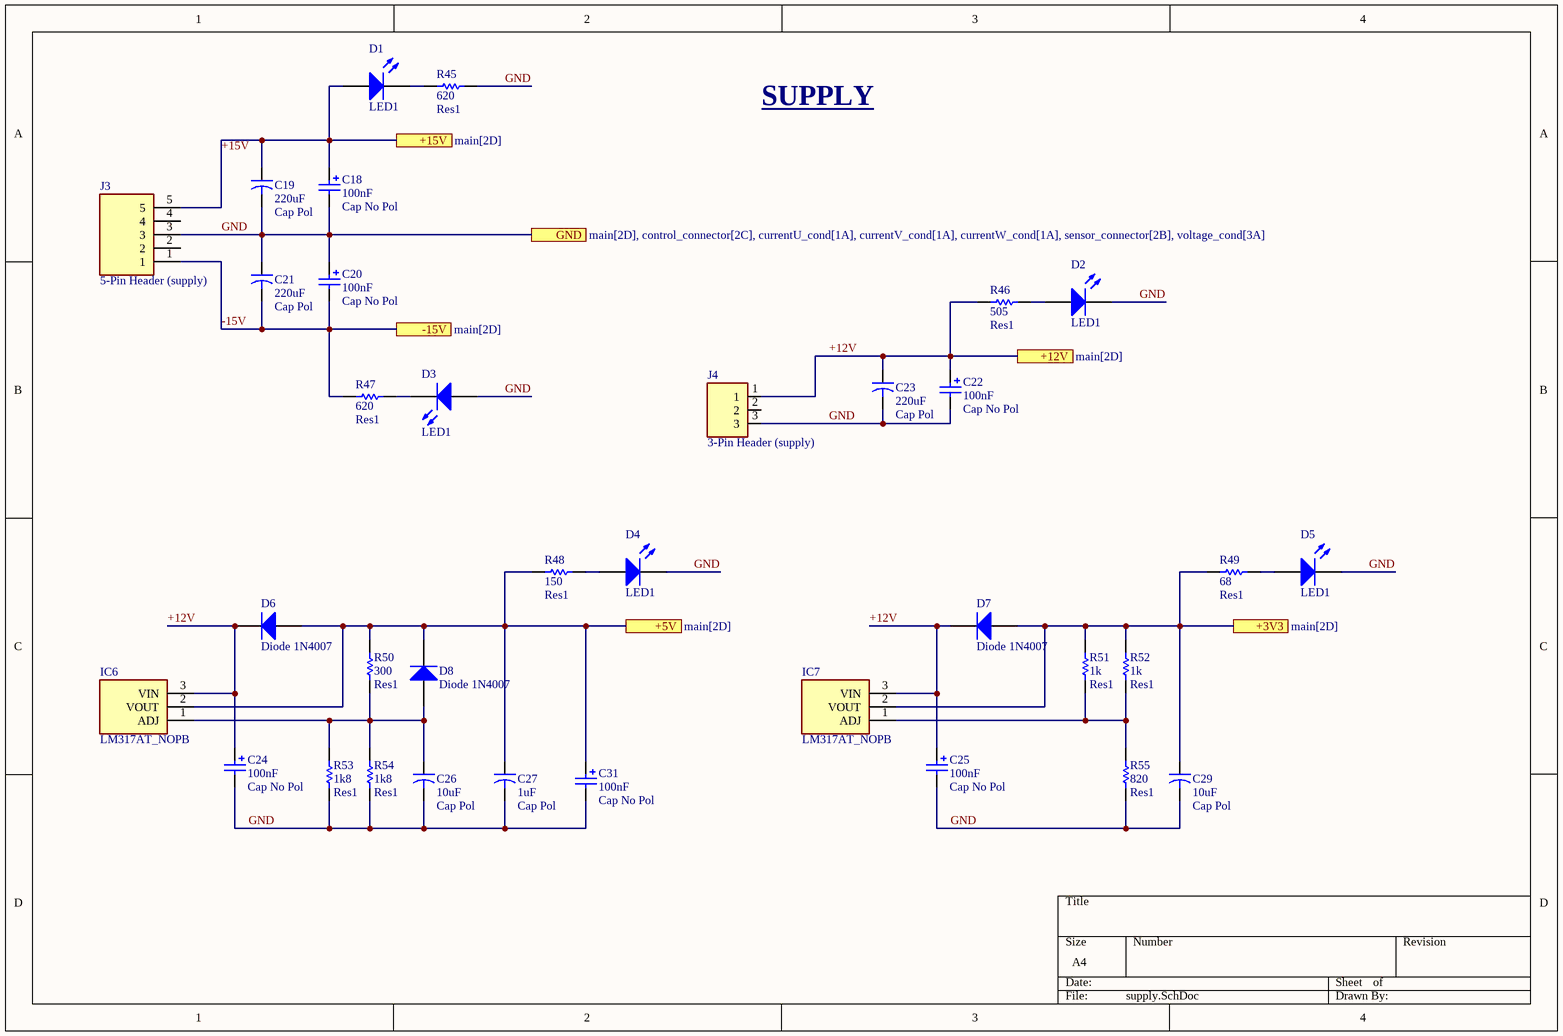
[diagram p10: supply.SchDoc]

### Parts
C18  Cap No Pol  value 100nF  [RAD-0.1_mod]
C19  Cap Pol  value 220uF  [CAPR5-4X5_mod]
C20  Cap No Pol  value 100nF  [RAD-0.1_mod]
C21  Cap Pol  value 220uF  [CAPR5-4X5_mod]
C22  Cap No Pol  value 100nF  [RAD-0.1_mod]
C23  Cap Pol  value 220uF  [CAPR5-4X5_mod]
C24  Cap No Pol  value 100nF  [RAD-0.1_mod]
C25  Cap No Pol  value 100nF  [RAD-0.1_mod]
C26  Cap Pol  value 10uF  [CAPR5-4X5_mod]
C27  Cap Pol  value 1uF  [CAPR5-4X5_mod]
C29  Cap Pol  value 10uF  [CAPR5-4X5_mod]
C31  Cap No Pol  value 100nF  [RAD-0.1_mod]
D1  LED1  [PIN2_mod]
D2  LED1  [PIN2_mod]
D3  LED1  [PIN2_mod]
D4  LED1  [PIN2_mod]
D5  LED1  [PIN2_mod]
D6  Diode 1N4007  [DO-41_mod]
D7  Diode 1N4007  [DO-41_mod]
D8  Diode 1N4007  [DO-41_mod]
IC6  LM317AT_NOPB  [TO254_mod]
IC7  LM317AT_NOPB  [TO254_mod]
J3  5-Pin Header (supply)  [MSTBA_5-PIN_HEADER_mod]
J4  3-Pin Header (supply)  [MSTBA_3-PIN_HEADER_mod]
R45  Res1  value 620  [AXIAL-0.3_mod]
R46  Res1  value 505  [AXIAL-0.3_mod]
R47  Res1  value 620  [AXIAL-0.3_mod]
R48  Res1  value 150  [AXIAL-0.3_mod]
R49  Res1  value 68  [AXIAL-0.3_mod]
R50  Res1  value 300  [AXIAL-0.3_mod]
R51  Res1  value 1k  [AXIAL-0.3_mod]
R52  Res1  value 1k  [AXIAL-0.3_mod]
R53  Res1  value 1k8  [AXIAL-0.3_mod]
R54  Res1  value 1k8  [AXIAL-0.3_mod]
R55  Res1  value 820  [AXIAL-0.3_mod]

### Ports
+3V3 (see main[2D]), +5V (see main[2D]), +12V (see main[2D]), +15V (see main[2D]), -15V (see main[2D]), GND (see main[2D], control_connector[2C], currentU_cond[1A], currentV_cond[1A], currentW_cond[1A], sensor_connector[2B], voltage_cond[3A])

### Nets
+3V3: C29.1 D7.1(A) IC7.2(VOUT) R49.1 R51.1 R52.1 ; port +3V3
+5V: C27.1 C31.1 D6.1(A) D8.2(K) IC6.2(VOUT) R48.1 R50.1 ; port +5V
+12V: C22.1 C23.1 C24.1 C25.1 D6.2(K) D7.2(K) IC6.3(VIN) IC7.3(VIN) J4.1 R46.1 ; port +12V
+15V: C18.1 C19.1 D1.1(A) J3.5 ; port +15V
-15V: C20.2 C21.2 J3.1 R47.2 ; port -15V
GND: C18.2 C19.2 C20.1 C21.1 C22.2 C23.2 C24.2 C25.2 C26.2 C27.2 C29.2 C31.2 D2.2(K) D3.1(A) D4.2(K) D5.2(K) J3.3 J4.3 R45.2 R53.2 R54.2 R55.2 ; port GND
NetC26_1: C26.1 D8.1(A) IC6.1(ADJ) R50.2 R53.1 R54.1
NetD1_2: D1.2(K) R45.1
NetD2_1: D2.1(A) R46.2
NetD3_2: D3.2(K) R47.1
NetD4_1: D4.1(A) R48.2
NetD5_1: D5.1(A) R49.2
NetIC7_1: IC7.1(ADJ) R51.2 R52.2 R55.1

Not connected (* = marked no-connect by the designer): J3 2 4; J4 2

### Notes on the sheet
- SUPPLY

### Library data of the parts
C18 C20 C22 C24 C25 C31 = Cap No Pol: Polarized Capacitor (Radial); Published: 8-Jun-2000; LatestRevisionDate: 17-Jul-2002; LatestRevisionNote: Re-released for DXP Platform.; PackageReference: RB7.6-15; Publisher: Altium Limited; PackageDescription: Polarized Capacitor (Radial); 2 Leads
C19 C21 C23 C26 C27 C29 = Cap Pol: Capacitor; Published: 23-Sep-2002; PackageReference: CAPR5-4X5; Publisher: Altium Limited; PackageDescription: Capacitor; 2 Leads
D1-D5 = LED1: Typical RED GaAs LED; Published: 8-Jun-2000; LatestRevisionDate: 08-Jul-2005; LatestRevisionNote: Mech Layer 1 removed.; PackageReference: LED-1; Publisher: Altium Limited; PackageDescription: LED; 2 Leads
D6-D8 = Diode 1N4007: 1 Amp General Purpose Rectifier; Published: 8-Jun-2000; LatestRevisionDate: 17-Jul-2002; LatestRevisionNote: Re-released for DXP Platform.; PackageVersion: Aug-1999; PackageReference: DO-41; Publisher: Altium Limited; PackageDescription: Diode, Axial; Body 5.2 x 2.7 mm (LxDia. max), Lead Dia. 0.86 mm (max); Code_JEDEC: DO-204-AL; DatasheetVersion: 1998; ComponentLink1Description: Manufacturer Link; ComponentLink1URL: http://www.fairchildsemi.com/; ComponentLink2Description: Datasheet; ComponentLink2URL: http://www.fairchildsemi.com/ds/1N%2F1N4001.pdf
IC6 IC7 = LM317AT_NOPB: Integrated Circuit; Manufacturer_Name: Texas Instruments; Manufacturer_Part_Number: LM317AT/NOPB; Datasheet Link: http://www.ti.com/lit/gpn/lm317a; Height: 4.7mm; Mouser Part Number: 926-LM317AT/NOPB; Mouser Price/Stock: https://www.mouser.co.uk/ProductDetail/Texas-Instruments/LM317AT-NOPB?qs=X1J7HmVL2ZFYFJRcNgsWcQ%3D%3D; Arrow Part Number: LM317AT/NOPB; Arrow Price/Stock: https://www.arrow.com/en/products/lm317atnopb/texas-instruments?region=nac
J3 = 1736175: Pluggable Terminal Blocks MSTBA 2,5/ 5-G- 5,08 VPE250; MF: Phoenix Contact; SnapEDA_Link: https://www.snapeda.com/parts/1736175/Phoenix+Contact/view-part/?ref=snap; Package: None; Value: *; MP: 1736175; Check_prices: https://www.snapeda.com/parts/1736175/Phoenix+Contact/view-part/?ref=eda
J4 = MSTBA_2,5/_3-G-5,08_1757255: 3 Position Terminal Block Header, Male Pins, Shrouded _4 Side_ 0.200 _5.08mm_ 90Â°, Right Angle Through Hole; MP: MSTBA 2,5/ 3-G-5,08 1757255; MF: Phoenix Contact; Value: *; Package: None; SnapEDA_Link: https://www.snapeda.com/parts/MSTBA%202%2C5/%203-G-5%2C08%201757255/Phoenix%20Contact/view-part/1675378/?ref=snap; Price: None; Availability: Unavailable
R45-R55 = Res1: Resistor; Published: 8-Jun-2000; LatestRevisionDate: 17-Jul-2002; LatestRevisionNote: Re-released for DXP Platform.; PackageReference: AXIAL-0.3; Publisher: Altium Limited; PackageDescription: Axial Device, Thru-Hole; 2 Leads; 0.3 in Pin Spacing

## Sheet led_VDC.SchDoc
size A; SheetNumber: 12; SheetTotal: 12; SPICEModelCacheQAAZNQEN: <root> / <DocumentId>QAAZNQEN</DocumentId> / <CacheFrame Number="0"> / <Model Name="led0" Kind="MDL"> / <Text>*Typ INFRARED GaAs LED: Vf=1.2V Vr=5V If=40mA trr=3uS / *LED Pinout: 1=A, 2=K / .MODEL LED0 D (IS=93.5P RS=84M N=2.63 BV=5 IBV=10U / + CJO=2.97P VJ=.75 M=.333 TT=4.32U)</Text> / </Model> / </CacheFrame> / </root>
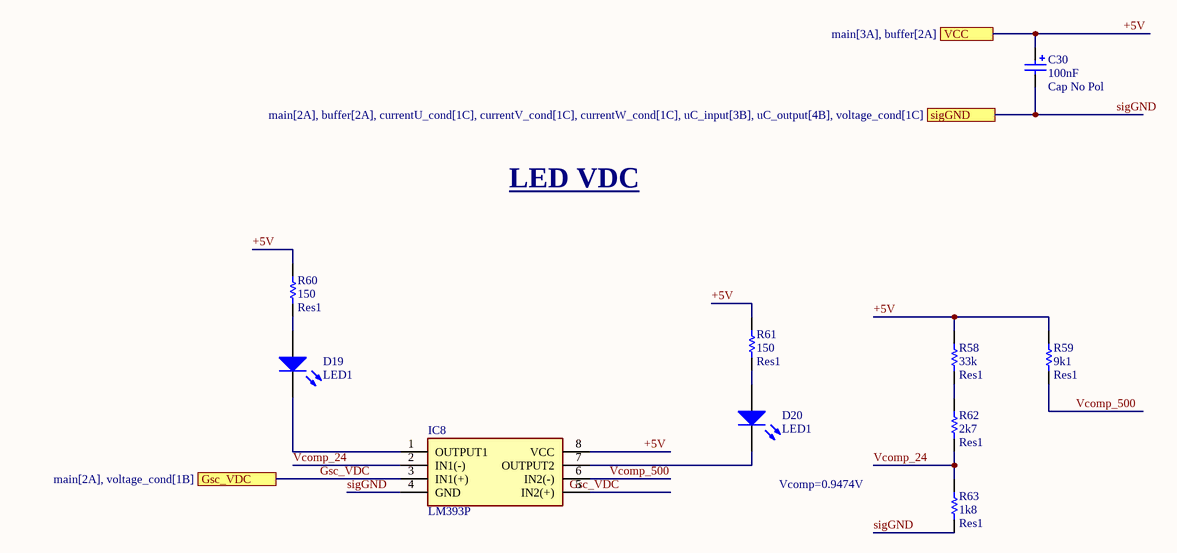
[diagram p11: led_VDC.SchDoc]

### Parts
C30  Cap No Pol  value 100nF  [RAD-0.1_mod]
D19  LED1  [PIN2_mod]
D20  LED1  [PIN2_mod]
IC8  LM393P  [DIP-8_mod]
R58  Res1  value 33k  [AXIAL-0.3_mod]
R59  Res1  value 9k1  [AXIAL-0.3_mod]
R60  Res1  value 150  [AXIAL-0.3_mod]
R61  Res1  value 150  [AXIAL-0.3_mod]
R62  Res1  value 2k7  [AXIAL-0.3_mod]
R63  Res1  value 1k8  [AXIAL-0.3_mod]

### Ports
Gsc_VDC (see main[2A], voltage_cond[1B]), sigGND (see main[2A], buffer[2A], currentU_cond[1C], currentV_cond[1C], currentW_cond[1C], uC_input[3B], uC_output[4B], voltage_cond[1C]), VCC (see main[3A], buffer[2A])

### Nets
+5V: C30.1 IC8.8(VCC) R58.2 R59.2 R60.2 R61.2 ; port VCC
sigGND: C30.2 IC8.4(GND) R63.1 ; port sigGND
Gsc_VDC: IC8.3(IN1(+)) IC8.5(IN2(+)) ; port Gsc_VDC
Vcomp_24: IC8.2(IN1(-)) R62.1 R63.2
Vcomp_500: IC8.6(IN2(-)) R59.1
NetD19_1: D19.1(A) R60.1
NetD19_2: D19.2(K) IC8.1(OUTPUT1)
NetD20_1: D20.1(A) R61.1
NetD20_2: D20.2(K) IC8.7(OUTPUT2)
NetR58_1: R58.1 R62.2

### Notes on the sheet
- LED VDC
- Vcomp=0.9474V

### Library data of the parts
C30 = Cap No Pol: Polarized Capacitor (Radial); Published: 8-Jun-2000; LatestRevisionDate: 17-Jul-2002; LatestRevisionNote: Re-released for DXP Platform.; PackageReference: RB7.6-15; Publisher: Altium Limited; PackageDescription: Polarized Capacitor (Radial); 2 Leads
D19 D20 = LED1: Typical RED GaAs LED; Published: 8-Jun-2000; LatestRevisionDate: 08-Jul-2005; LatestRevisionNote: Mech Layer 1 removed.; PackageReference: LED-1; Publisher: Altium Limited; PackageDescription: LED; 2 Leads
IC8 = LM393N: Integrated Circuit; Manufacturer_Name: Texas Instruments; Datasheet Link: https://datasheet.datasheetarchive.com/originals/distributors/Datasheets-SFU2/DSASFU100036444.pdf; Height: 5.33mm; Manufacturer_Part_Number: LM393N; Mouser Part Number: 926-LM393N; Mouser Price/Stock: https://www.mouser.co.uk/ProductDetail/Texas-Instruments/LM393N?qs=QbsRYf82W3HvgSG%252BWhL68w%3D%3D
R58-R63 = Res1: Resistor; Published: 8-Jun-2000; LatestRevisionDate: 17-Jul-2002; LatestRevisionNote: Re-released for DXP Platform.; PackageReference: AXIAL-0.3; Publisher: Altium Limited; PackageDescription: Axial Device, Thru-Hole; 2 Leads; 0.3 in Pin Spacing

## Nets that join several sheets
+3V3: buffer (R32.2), uC_input (6 pins), supply (6 pins)
+5V: buffer (C17.1 IC5.16), control_connector (R31.2), supply (7 pins), led_VDC (6 pins)
+12V: control_connector (J2.6 J2.15 J2.21 J2.24), supply (10 pins)
+15V: sensor_connector (J1.14 J1.15 J1.16), currentU_cond (C1.1 IC1.4 R5.1), voltage_cond (C13.1 IC4.4), currentV_cond (C5.1 IC2.4 R13.1), currentW_cond (C9.1 IC3.4 R21.1), supply (C18.1 C19.1 D1.1 J3.5)
-15V: sensor_connector (J1.23 J1.24 J1.25), currentU_cond (C2.2 IC1.8), voltage_cond (C14.2 IC4.8), currentV_cond (C6.2 IC2.8), currentW_cond (C10.2 IC3.8), supply (C20.2 C21.2 J3.1 R47.2)
GND: main (NT1.1), control_connector (8 pins), sensor_connector (6 pins), currentU_cond (C1.2 C2.1), voltage_cond (C13.2 C14.1), currentV_cond (C5.2 C6.1), currentW_cond (C9.2 C10.1), supply (22 pins)
sigGND: main (NT1.0), buffer (15 pins), currentU_cond (C4.2 IC1.3 IC1.5), voltage_cond (C16.1 IC4.3 IC4.5), uC_input (6 pins), uC_output (P2.13), currentV_cond (C8.2 IC2.3 IC2.5), currentW_cond (C12.2 IC3.3 IC3.5), led_VDC (C30.2 IC8.4 R63.1)
A/D A2: currentU_cond (C3.2 IC1.7 R3.2), uC_input (D14.1 D16.2 P1.1)
A/D A3: voltage_cond (C15.2 IC4.7 R25.2), uC_input (D10.1 D12.2 P1.3)
A/D A4: uC_input (D11.1 D13.2 P1.5), currentV_cond (C7.2 IC2.7 R11.2)
A/D A5: uC_input (D15.1 D17.2 P1.7), currentW_cond (C11.2 IC3.7 R19.2)
Fault: control_connector (7 pins), uC_input (P1.12 Q.2 R56.2)
Gsc_VDC: sensor_connector (J1.2), voltage_cond (R26.1), led_VDC (IC8.3 IC8.5)
NetJ1_3: sensor_connector (J1.3), currentU_cond (R1.1 R4.1)
NetJ1_4: sensor_connector (J1.4), currentV_cond (R9.1 R12.1)
NetJ1_5: sensor_connector (J1.5), currentW_cond (R17.1 R20.1)
PWM1_Gsc: buffer (IC5.9 R44.2), control_connector (J2.3)
PWM2_Gsc: buffer (IC5.7 R42.2), control_connector (J2.20)
PWM2A: buffer (IC5.2 R33.2), uC_output (P2.2)
PWM2B: buffer (IC5.14 R35.2), uC_output (P2.11)
PWM3_Gsc: buffer (IC5.3 R34.2), control_connector (J2.14)
PWM3A: buffer (IC5.10 R43.2), uC_output (P2.1)
PWM3B: buffer (IC5.6 R41.2), uC_output (P2.10)
PWM4_Gsc: buffer (IC5.13 R36.2), control_connector (J2.23)
PWM5_Gsc: buffer (IC5.5 R38.2), control_connector (J2.17)
PWM6_Gsc: buffer (IC5.11 R40.2), control_connector (J2.12)
PWM6A: buffer (IC5.4 R37.2), uC_output (P2.6)
PWM6B: buffer (IC5.12 R39.2), uC_output (P2.7)